# Altium schematic sheet schematic.SchDoc
size A; SheetNumber: 1; SheetTotal: 1
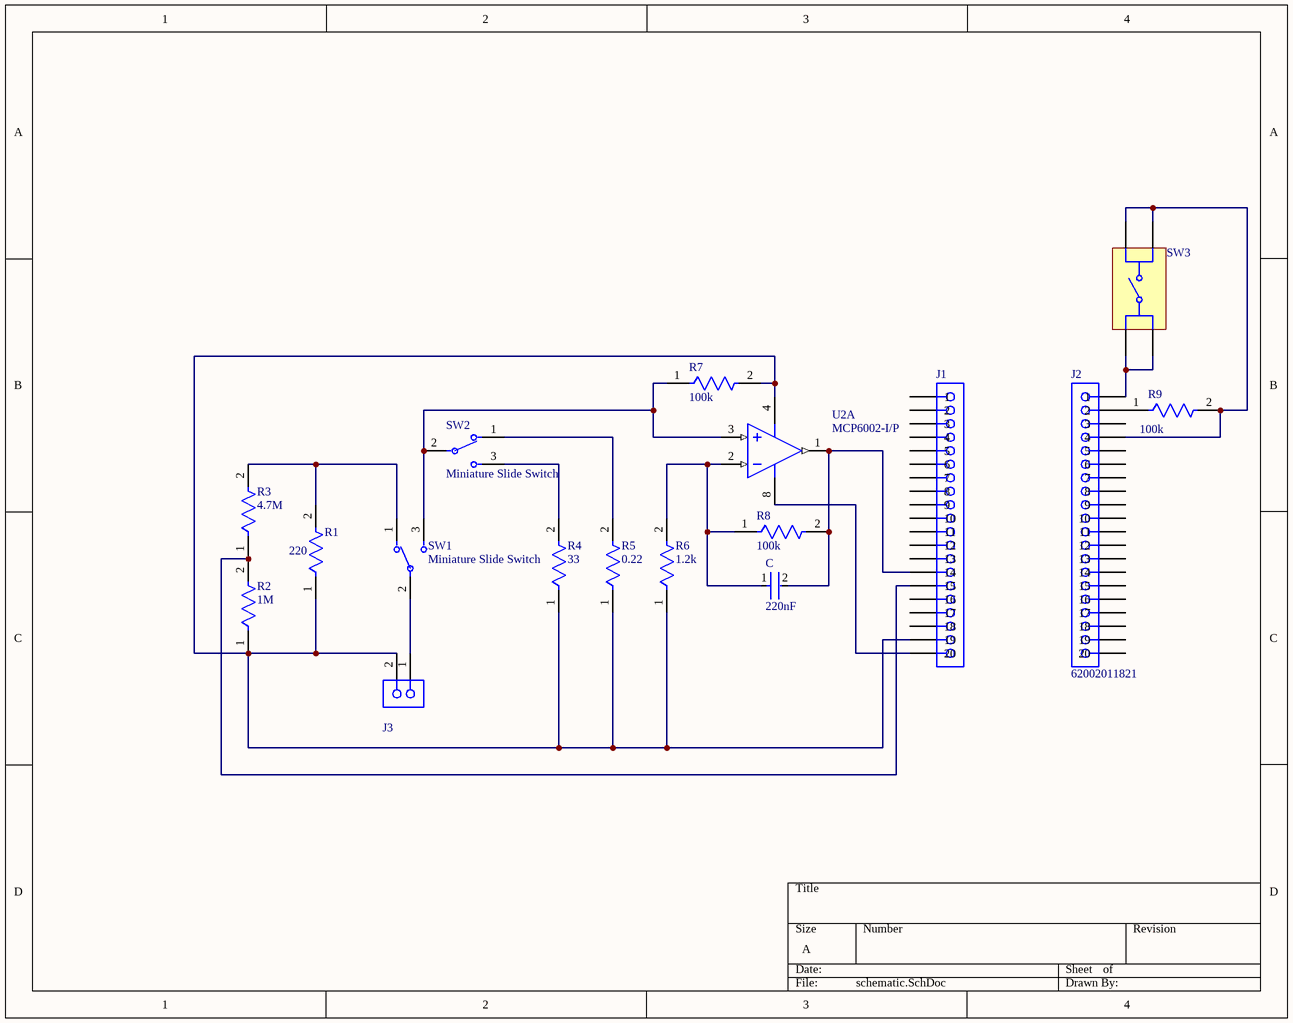
[diagram p0: schematic.SchDoc]

## Parts
C  220nF  [FP-GRM155-0_05-MFG]
J1  Vertical Socket Header  [62002011821]  (value not drawn)
J2  62002011821  [62002011821]
J3  Screw Terminal Block  [691417320002S]  (value not drawn)
R1  220  [FP-PTF56-MFG]
R2  1M  [FP-PTF56-MFG]
R3  4.7M  [FP-PTF56-MFG]
R4  33  [FP-PTF56-MFG]
R5  0.22  [FP-PTF56-MFG]
R6  1.2k  [FP-PTF56-MFG]
R7  100k  [FP-PTF56-MFG]
R8  100k  [FP-PTF56-MFG]
R9  100k  [FP-PTF56-MFG]
SW1  Miniature Slide Switch  [FP-1101M2S3CGE2-MFG]
SW2  Miniature Slide Switch  [FP-1101M2S3CGE2-MFG]
SW3  Push Button  [430473035826]  (value not drawn)
U2  MCP6002-I/P  [PDIP300-P8]  (part A of 2)

## Nets
NetC_1: C.1 R6.2 R8.1 U2.2(VINA-)
NetC_2: C.2 J1.14 R8.2 U2.1(VOUTA)
NetJ1_15: J1.15 R2.2 R3.1
NetJ1_19: J1.19 J3.2 R1.1 R2.1 R4.1 R5.1 R6.1 R7.2 U2.4(VSS)
NetJ1_20: J1.20 U2.8(VDD)
NetJ2_1: J2.1 SW3.A1 SW3.A2
NetJ2_2: J2.2 R9.1
NetJ2_4: J2.4 R9.2 SW3.B1 SW3.B2
NetJ3_1: J3.1 SW1.2(COMM)
NetR1_2: R1.2 R3.2 SW1.1
NetR4_2: R4.2 SW2.3
NetR5_2: R5.2 SW2.1
NetR7_1: R7.1 SW1.3 SW2.2(COMM) U2.3(VINA+)

Not connected (* = marked no-connect by the designer): J1 1 2 3 4 5 6 7 8 9 10 11 12 13 16 17 18; J2 3 5 6 7 8 9 10 11 12 13 14 15 16 17 18 19 20

## Library data of the parts
C = CMP-06035-063955-1: Multilayer Ceramic Capacitor 0.22uF 10% 63V X5R 0402 Paper T/R
J1 J2 = CMP-1502-01214-3: NexarPartId: 65162172; Contact Resistance: 20mΩ; Current Rating: 2A; Operating Supply Voltage: 250V; Gender: Female; Orientation: Vertical; Number of Pins: 20; Lead Pitch: 2mm
J3 = CMP-1502-02970-2: NexarPartId: 105951391
R1 = CMP-00030-29520625-1: Res Metal Film 220 Ohm 1% ± 5ppm/°C 1/8W Axial Leaded T/R; Resistance: 250kΩ; Lead Diameter: 640µm; Voltage Rating: 300V; Power Rating: 125mW; Mount: Through Hole; Temperature Coefficient: 5ppm/°C; NexarPartId: 29520625; Min Operating Temperature: -55°C; Length: 6.35mm; RoHS: Compliant; Composition: Metal Film; Case/Package: Axial; Weight: 350.003213mg; Height: 2.54mm; Max Operating Temperature: 150°C; Termination: Axial; Tolerance: 1%
R2 = CMP-00030-29520625-1: Res Metal Film 1MOhm 1% ± 5ppm/°C 1/8W Axial Leaded T/R; Resistance: 250kΩ; Lead Diameter: 640µm; Voltage Rating: 300V; Power Rating: 125mW; Mount: Through Hole; Temperature Coefficient: 5ppm/°C; NexarPartId: 29520625; Min Operating Temperature: -55°C; Length: 6.35mm; RoHS: Compliant; Composition: Metal Film; Case/Package: Axial; Weight: 350.003213mg; Height: 2.54mm; Max Operating Temperature: 150°C; Termination: Axial; Tolerance: 1%
R3 = CMP-00030-29520625-1: Res Metal Film 4.7MOhm 1% ± 5ppm/°C 1/8W Axial Leaded T/R; Resistance: 250kΩ; Lead Diameter: 640µm; Voltage Rating: 300V; Power Rating: 125mW; Mount: Through Hole; Temperature Coefficient: 5ppm/°C; NexarPartId: 29520625; Min Operating Temperature: -55°C; Length: 6.35mm; RoHS: Compliant; Composition: Metal Film; Case/Package: Axial; Weight: 350.003213mg; Height: 2.54mm; Max Operating Temperature: 150°C; Termination: Axial; Tolerance: 1%
R4 = CMP-00030-29520625-1: Res Metal Film 33Ohm 1% ± 5ppm/°C 1/8W Axial Leaded T/R; Resistance: 250kΩ; Lead Diameter: 640µm; Voltage Rating: 300V; Power Rating: 125mW; Mount: Through Hole; Temperature Coefficient: 5ppm/°C; NexarPartId: 29520625; Min Operating Temperature: -55°C; Length: 6.35mm; RoHS: Compliant; Composition: Metal Film; Case/Package: Axial; Weight: 350.003213mg; Height: 2.54mm; Max Operating Temperature: 150°C; Termination: Axial; Tolerance: 1%
R5 = CMP-00030-29520625-1: Res Metal Film 0.22Ohm 1% ± 5ppm/°C 1/8W Axial Leaded T/R; Resistance: 250kΩ; Lead Diameter: 640µm; Voltage Rating: 300V; Power Rating: 125mW; Mount: Through Hole; Temperature Coefficient: 5ppm/°C; NexarPartId: 29520625; Min Operating Temperature: -55°C; Length: 6.35mm; RoHS: Compliant; Composition: Metal Film; Case/Package: Axial; Weight: 350.003213mg; Height: 2.54mm; Max Operating Temperature: 150°C; Termination: Axial; Tolerance: 1%
R6 = CMP-00030-29520625-1: Res Metal Film 1.2kOhm 1% ± 5ppm/°C 1/8W Axial Leaded T/R; Resistance: 250kΩ; Lead Diameter: 640µm; Voltage Rating: 300V; Power Rating: 125mW; Mount: Through Hole; Temperature Coefficient: 5ppm/°C; NexarPartId: 29520625; Min Operating Temperature: -55°C; Length: 6.35mm; RoHS: Compliant; Composition: Metal Film; Case/Package: Axial; Weight: 350.003213mg; Height: 2.54mm; Max Operating Temperature: 150°C; Termination: Axial; Tolerance: 1%
R7 R8 = CMP-00030-29520625-1: Res Metal Film 100kOhm 1% ± 5ppm/°C 1/8W Axial Leaded T/R; Resistance: 250kΩ; Lead Diameter: 640µm; Voltage Rating: 300V; Power Rating: 125mW; Mount: Through Hole; Temperature Coefficient: 5ppm/°C; NexarPartId: 29520625; Min Operating Temperature: -55°C; Length: 6.35mm; RoHS: Compliant; Composition: Metal Film; Case/Package: Axial; Weight: 350.003213mg; Height: 2.54mm; Max Operating Temperature: 150°C; Termination: Axial; Tolerance: 1%
R9 = CMP-00030-29520625-1: PTF56250K00FZEB Res Metal Film 250kOhm 1% ± 5ppm/°C 1/8W Axial Leaded T/R; Resistance: 250kΩ; Lead Diameter: 640µm; Voltage Rating: 300V; Power Rating: 125mW; Mount: Through Hole; Temperature Coefficient: 5ppm/°C; NexarPartId: 29520625; Min Operating Temperature: -55°C; Length: 6.35mm; RoHS: Compliant; Composition: Metal Film; Case/Package: Axial; Weight: 350.003213mg; Height: 2.54mm; Max Operating Temperature: 150°C; Termination: Axial; Tolerance: 1%
SW1 SW2 = CMP-10038-000004-1: SWITCH SLIDE SPDT 6A 120V; Manufacturer: C&K Components; Manufacturer Part Number: 1101M2S3CGE2; Contact Resistance: 10mΩ; Voltage Rating Dc: 28V; Electromechanical Life: 40000Cycles; Octopart: https://octopart.com/1101m2s3cge2-c%26k+components-2817222; Temperature Range Low: -30°C; Automotive: No; Device Class L2: Switches; RoHS: TRUE; Device Class L3: Slide Switches; Throw Configuration: SPDT; Temperature Range High: +65°C; Mouser Description: Switch Slide ON None ON SPDT Top Slide 6A 250VAC 28VDC 0.4VA PC Pins Thru-Hole Bulk; Contact Current Rating: 6A; Temperature: -30°C to +65°C; ComponentLink2Description: Datasheet; Lead Free: Yes; Package: 1101M2S3CGE2; Height: 13.34mm; Voltage Rating Ac: 120V; Digikey Description: SWITCH SLIDE SPDT 6A 120V; ComponentLink2URL: https://www.ckswitches.com/media/1429/1000.pdf; Device Class L1: Electromechanical; Category: Switch; Mount: Through Hole
SW3 = CMP-1455-00006-3: Switch Tactile Spst-no 0.05A 12V; Throw Configuration: SPST; Switch Travel: 250µm; Actuator Material: Liquid Crystal Polymer, Polymer; Current Rating: 50mA; Insulation Resistance: 100MΩ; Illumination Type: Non-Illuminated; Switch Function: Off-Mom; Mechanical Life: 500kcycles; Voltage Rating: 12V; Max Operating Temperature: 85°C; Packaging: Tape and Reel; RoHS: Compliant; Height: 3.5mm; Contact Plating: Silver; Mount: Surface Mount; Min Operating Temperature: -40°C
U2 = CMP-0187-00119-3: None; Max Frequency: 1kHz; Operating Supply Current: 100uA; Amplifier Type: GENERAL PURPOSE; Number of Channels: 2; Power Supply Rejection Ratio (PSRR): 86dB; Max Input Voltage: 6V; Bandwidth: 1MHz; Voltage Gain: 112dB; Input Bias Current: 1pA; Slew Rate-Nom: 0.6V/µs; Output Current: 23mA; Input Offset Voltage-Max: 4.5mV; Common Mode Rejection Ratio: 60dB; Min Input Voltage: 1.8V; Operating Supply Voltage: 5.5V; Height: 0.195inch; Number of Circuits: 2; REACH SVHC: No SVHC; Max Supply Voltage: 6V; Supply Current: 100uA; Gain Bandwidth Product: 1MHz; Radiation Hardening: No; Mount: Through Hole; Length: 0.4inch; Number of Pins: 8; Min Operating Temperature: -40°C; Case/Package: PDIP; Number of Amplifiers: 2; RoHS Compliant: Yes; Lead Free: Lead Free; Number of Elements: 2; Technology: CMOS; Width: 0.28inch; Slew Rate: 0.6V/µs; Packaging: Rail/Tube; Output Current per Channel: 23mA; Max Operating Temperature: 85°C; Nominal Supply Current: 100uA; Min Supply Voltage: 1.8V; Input Offset Voltage (Vos): 4.5mV; Unity Gain Bandwidth Product: 1MHz; Package Quantity: 60